# Altium schematic sheet schematic.SchDoc
size A3; SheetNumber: 1; SheetTotal: 1
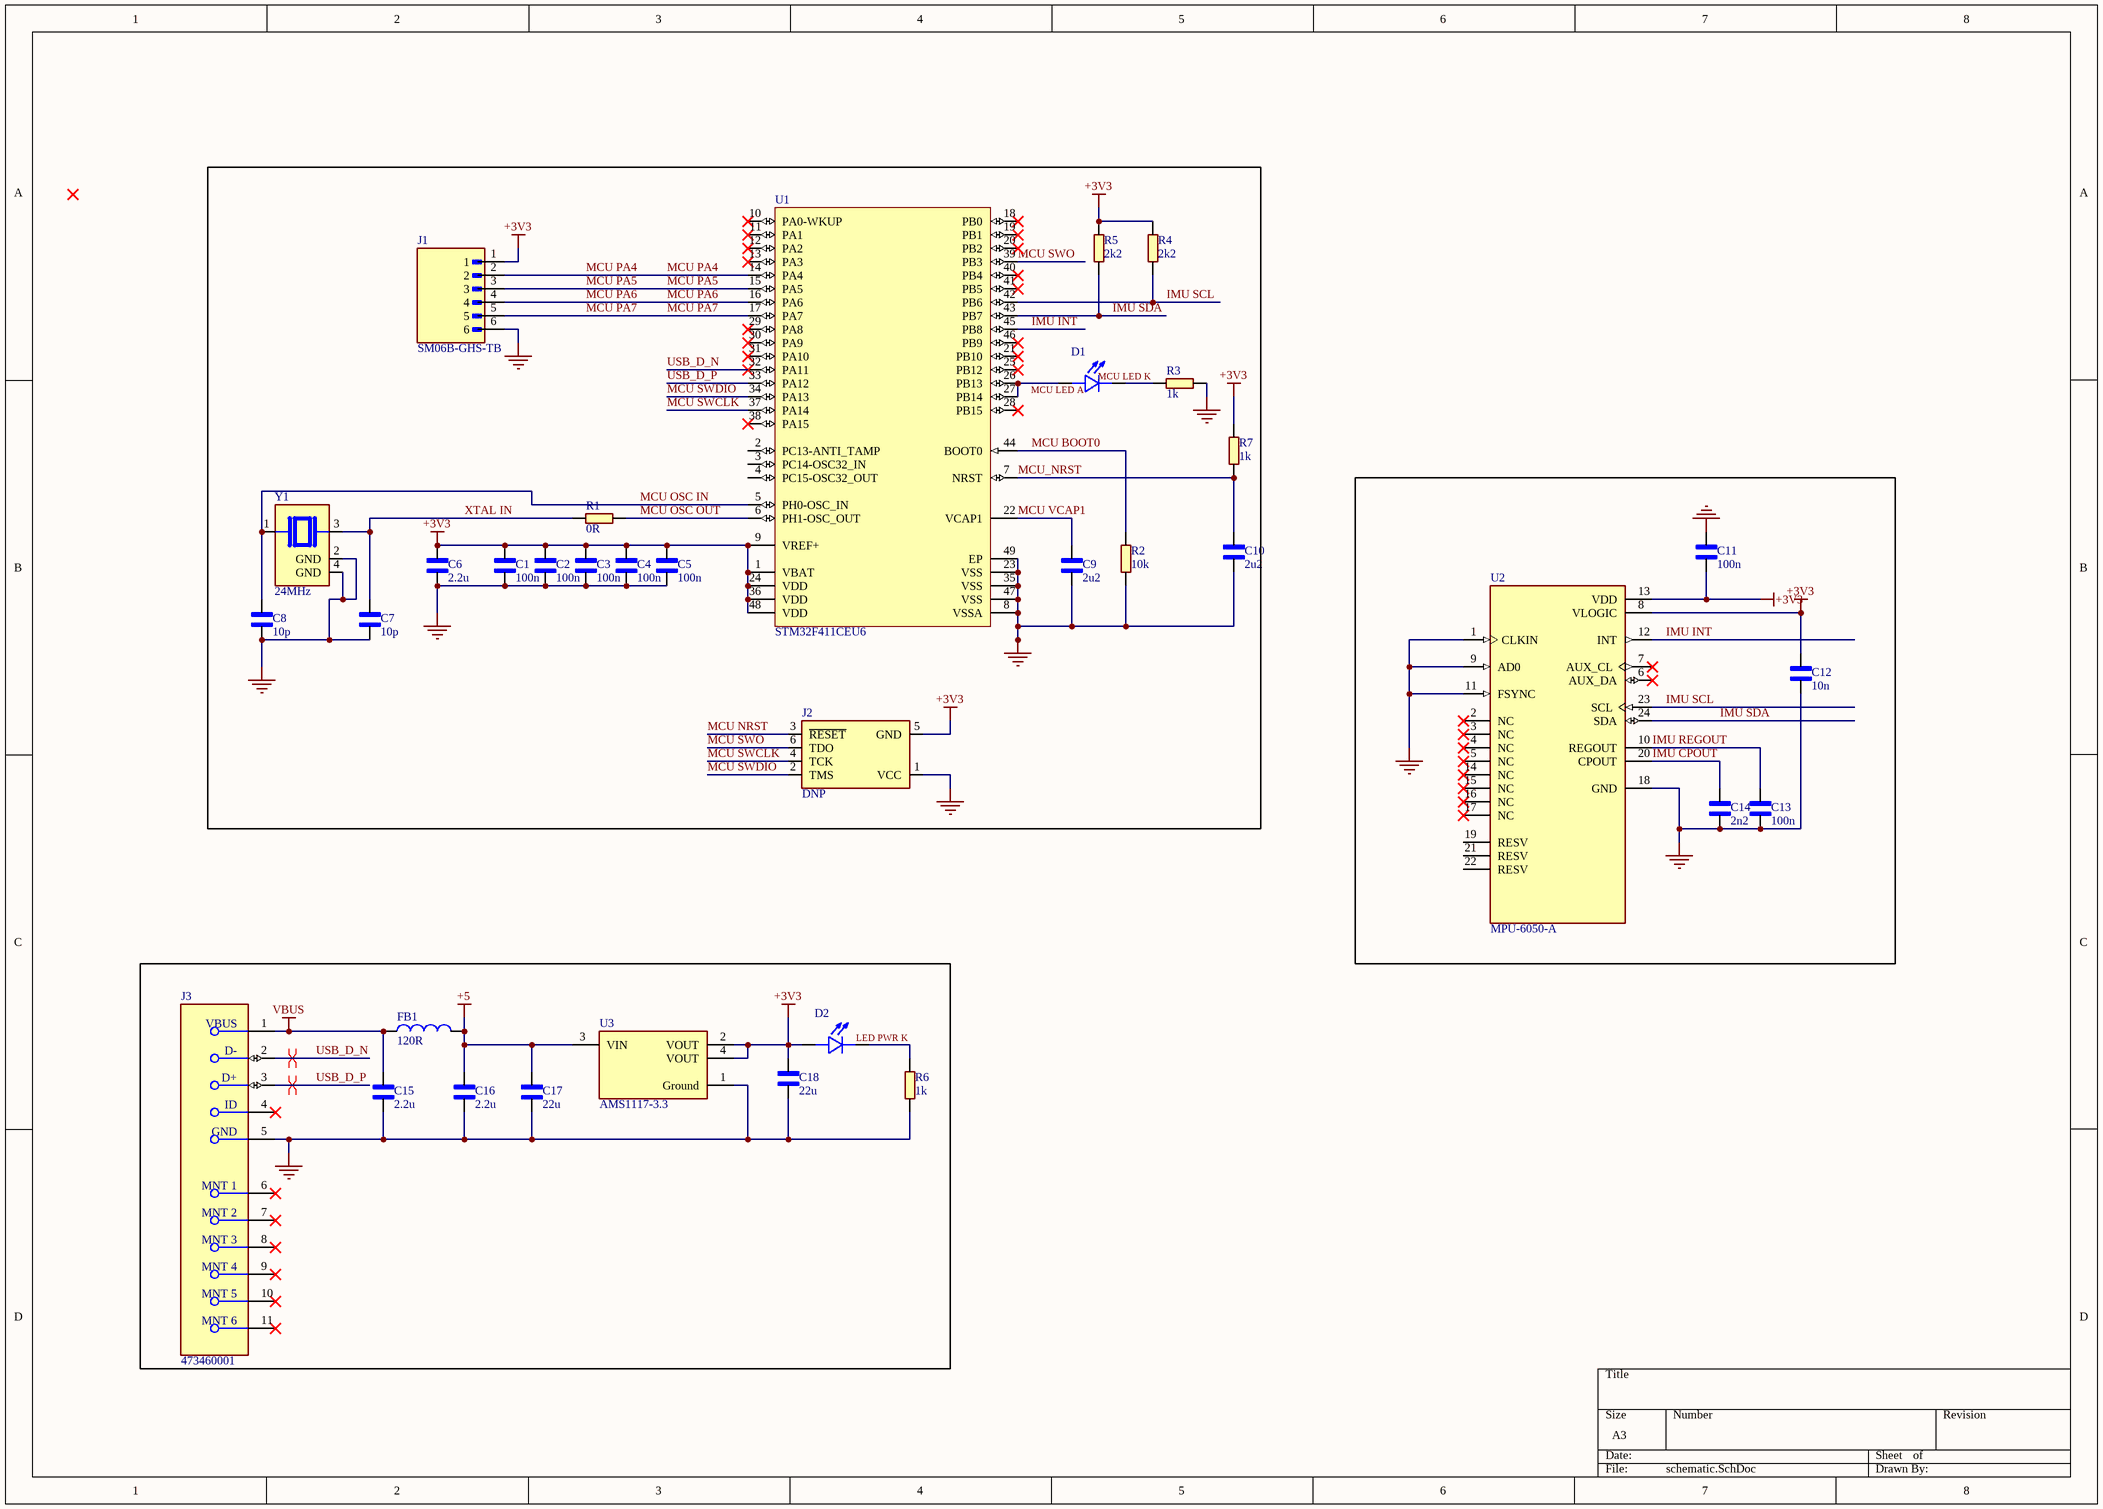
[diagram p0: schematic.SchDoc]

## Parts
C1  100n  [CAPC1005X55N]
C2  100n  [CAPC1005X55N]
C3  100n  [CAPC1005X55N]
C4  100n  [CAPC1005X55N]
C5  100n  [CAPC1005X55N]
C6  2.2u  [CAPC1608X90N]
C7  10p  [CAPC1005X55N]
C8  10p  [CAPC1005X55N]
C9  2u2  [CAPC1608X90N]
C10  2u2  [CAPC1005X55N]
C11  100n  [CAPC1005X55N]
C12  10n  [CAPC1005X55N]
C13  100n  [CAPC1005X55N]
C14  2n2  [CAPC1005X55N]
C15  2.2u  [CAPC1608X90N]
C16  2.2u  [CAPC1608X90N]
C17  22u  [CAPC1608X90N]
C18  22u  [CAPC1608X90N]
D1  APHHS1005LSECK/J3-PF  [LED_APHHS1005LSECK/J3-PF]  (value not drawn)
D2  APHHS1005LCGCK  [LED_APHHS1005LCGCK]  (value not drawn)
FB1  120R  [WE-PF_1280]
J1  SM06B-GHS-TB  [JST_SM06B-GHS-TB]
J2  DNP  [TC2030-IDC-NL]
J3  473460001  [FP-473460001-MFG]
R1  0R  [0402]
R2  10k  [0402]
R3  1k  [0402]
R4  2k2  [0402]
R5  2k2  [0402]
R6  1k  [0402]
R7  1k  [0402]
U1  STM32F411CEU6  [STM-UFQFPN48_L]
U2  MPU-6050-A  [QFN50P400X400X95-24N]
U3  AMS1117-3.3  [FP-AMS1117-IPC_C]
Y1  24MHz  [XTAL_TSX-3225_24.0000MF15V-C0]

## Nets
+3V3: C1.2 C2.2 C3.2 C4.2 C5.2 C6.2 C11.1 C12.2 C18.2 D2.2(A) J1.1 J2.5(GND) R4.2 R5.2 R7.1 U1.1(VBAT) U1.9(VREF+) U1.24(VDD) U1.36(VDD) U1.48(VDD) U2.8(VLOGIC) U2.13(VDD) U3.2(VOUT) U3.4(VOUT)  [also labelled VCC]
+5: C16.2 C17.2 FB1.2 U3.3(VIN)
GND: C1.1 C2.1 C3.1 C4.1 C5.1 C6.1 C7.1 C8.1 C9.1 C10.1 C11.2 C12.1 C13.1 C14.1 C15.1 C16.1 C17.1 C18.1 J1.6 J2.1(VCC) J3.5(GND) R2.1 R3.1 R6.1 U1.8(VSSA) U1.23(VSS) U1.35(VSS) U1.47(VSS) U1.49(EP) U2.1(CLKIN) U2.9(AD0) U2.11(FSYNC) U2.18(GND) U3.1(Ground) Y1.2(GND) Y1.4(GND)
VBUS: C15.2 FB1.1 J3.1(VBUS)
IMU CPOUT: C14.2 U2.20(CPOUT)
IMU INT: U1.45(PB8) U2.12(INT)
IMU REGOUT: C13.2 U2.10(REGOUT)
IMU SCL: R4.1 U1.42(PB6) U2.23(SCL)
IMU SDA: R5.1 U1.43(PB7) U2.24(SDA)
MCU BOOT0: R2.2 U1.44(BOOT0)
MCU LED K: D1.1(C) R3.2
MCU NRST: J2.3(~{RESET})
MCU OSC IN: C8.2 U1.5(PH0-OSC_IN) Y1.1
MCU OSC OUT: R1.2 U1.6(PH1-OSC_OUT)
MCU PA4: J1.2 U1.14(PA4)
MCU PA5: J1.3 U1.15(PA5)
MCU PA6: J1.4 U1.16(PA6)
MCU PA7: J1.5 U1.17(PA7)
MCU SWCLK: J2.4(TCK) U1.37(PA14)
MCU SWDIO: J2.2(TMS) U1.34(PA13)
MCU SWO: J2.6(TDO) U1.39(PB3)
MCU VCAP1: C9.2 U1.22(VCAP1)
MCU_NRST: C10.2 R7.2 U1.7(NRST)
USB_D_N: J3.2(D-) U1.32(PA11)
USB_D_P: J3.3(D+) U1.33(PA12)
XTAL IN: C7.2 R1.1 Y1.3
NetD1_2: D1.2(A) U1.26(PB13) U1.27(PB14)
NetD2_1: D2.1(C) R6.2

Not connected (* = marked no-connect by the designer): J3 4(ID)* 6(MNT_1)* 7(MNT_2)* 8(MNT_3)* 9(MNT_4)* 10(MNT_5)* 11(MNT_6)*; U1 2(PC13-ANTI_TAMP) 3(PC14-OSC32_IN) 4(PC15-OSC32_OUT) 10(PA0-WKUP)* 11(PA1)* 12(PA2)* 13(PA3)* 18(PB0)* 19(PB1)* 20(PB2)* 21(PB10)* 25(PB12)* 28(PB15)* 29(PA8)* 30(PA9)* 31(PA10)* 38(PA15)* 40(PB4)* 41(PB5)* 46(PB9)*; U2 2(NC)* 3(NC)* 4(NC)* 5(NC)* 6(AUX_DA)* 7(AUX_CL)* 14(NC)* 15(NC)* 16(NC)* 17(NC)* 19(RESV) 21(RESV) 22(RESV)

## Layout directives
differential pair: USB_D_N, USB_D_P

## Notes on the sheet
- Labels drawn without touching a wire or pin: LED PWR K, MCU LED A

## Library data of the parts
C1-C5 C7 C8 C10-C14 = C0402C103K4RAC: 10000 pF Â±10% 16V Ceramic Capacitor X7R 0402 (1005 Metric); MF: KEMET; SnapEDA_Link: https://www.snapeda.com/parts/C0402C103K4RAC/KEMET/view-part/?ref=snap; Package: 402-2 KEMET; Value: *; MP: C0402C103K4RAC; Check_prices: https://www.snapeda.com/parts/C0402C103K4RAC/KEMET/view-part/?ref=eda
C6 C9 C15-C18 = C0603C104J4RAC: 0.1 ÂµF Â±5% 16V Ceramic Capacitor X7R 0603 (1608 Metric); MF: KEMET; SnapEDA_Link: https://www.snapeda.com/parts/C0603C104J4RAC/KEMET/view-part/?ref=snap; Package: 603-2 KEMET; Value: *; MP: C0603C104J4RAC; Check_prices: https://www.snapeda.com/parts/C0603C104J4RAC/KEMET/view-part/?ref=eda
D1 = APHHS1005LSECK/J3-PF: Red 625nm LED Indication - Discrete 1.8V 0402 (1005 Metric); MF: Kingbright; SnapEDA_Link: https://www.snapeda.com/parts/APHHS1005LSECK/J3-PF/Kingbright/view-part/?ref=snap; Package: 0402 Kingbright Corporation; Value: *; MP: APHHS1005LSECK/J3-PF; Check_prices: https://www.snapeda.com/parts/APHHS1005LSECK/J3-PF/Kingbright/view-part/?ref=eda
D2 = APHHS1005LCGCK: Green 570nm LED Indication - Discrete 1.9V 0402 (1005 Metric); MF: Kingbright; SnapEDA_Link: https://www.snapeda.com/parts/APHHS1005LCGCK/Kingbright/view-part/?ref=snap; Package: 0402 Kingbright Corporation; Value: *; MP: APHHS1005LCGCK; Check_prices: https://www.snapeda.com/parts/APHHS1005LCGCK/Kingbright/view-part/?ref=eda
FB1 = WE-PF_1280: FERRITE BEAD 185 OHM 2SMD 1LN; MF: WÃ¼rth Elektronik; MP: 7427929115; SnapEDA_Link: https://www.snapeda.com/parts/7427929115/W%25C3%25BCrth+Elektronik+Midcom/view-part/?ref=snap; Package: SMD-2 WÃ¼rth Elektronik; Value: *; Check_prices: https://www.snapeda.com/parts/7427929115/W%25C3%25BCrth+Elektronik+Midcom/view-part/?ref=eda
J1 = SM06B-GHS-TB: Connector Header Surface Mount, Right Angle 6 position 0.049 (1.25mm); MF: JST Sales; SnapEDA_Link: https://www.snapeda.com/parts/SM06B-GHS-TB/JST/view-part/?ref=snap; Package: None; Value: *; MP: SM06B-GHS-TB; Check_prices: https://www.snapeda.com/parts/SM06B-GHS-TB/JST/view-part/?ref=eda
J2 = TC2030-CTX: CortexÂ® Plug-Of-Nailsâ„¢ Adapter Cable; MF: Tag-Connect LLC; Availability: Unavailable; Package: None; MP: TC2030-CTX; SnapEDA_Link: https://www.snapeda.com/parts/TC2030-CTX/Tag-Connect%20LLC/view-part/225831/?ref=snap; Value: *; Price: None
J3 = CMP-2000-05246-2: CONN RCPT USB2.0 MICRO B SMD R/A; Manufacturer: Molex; Conn Orientation: Right Angle; Is Female: yes; Shielding: true; Pitch: 0.65mm; Number Of Contacts: 5; Voltage Rating: 30V; Current Rating: 1.8A; Device Class L2: USB Connectors; Digikey Description: CONN RCPT USB2.0 MICRO B SMD R/A; Height: 2.945mm; RoHS: TRUE; ComponentLink2Description: Datasheet; Octopart: https://octopart.com/47346-0001-molex-7164928; Automotive: No; Package: 0; Category: Conn; Device Class L1: Connectors; Usb Standard: USB 2.0; Temperature: -30°C to +85°C; Temperature Range Low: -30°C; Footprint Url: https://www.molex.com/pdm_docs/sd/473460001_sd.pdf; ComponentLink2URL: https://www.molex.com/webdocs/datasheets/pdf/en-us/0473460001_IO_CONNECTORS.pdf; Lead Free: Yes; Manufacturer Part Number: 473460001; Contact Material: Gold,Nickel; Temperature Range High: +85°C; Device Class L3: unset
R1-R7 = R0402: Reducer,NEMA 1,4 X 2 1/2 | Wiegmann R0402; SnapEDA_Link: https://www.snapeda.com/parts/R0402/Wiegmann/view-part/?ref=snap; Package: None; Value: *; MF: Wiegmann; MP: R0402; Check_prices: https://www.snapeda.com/parts/R0402/Wiegmann/view-part/?ref=eda
U1 = CMP-0243-00165-1: ARM Cortex-M4 32-bit MCU+FPU, 512 KB Flash, 128 KB RAM, 36 I/Os, 48-Pin UFQFPN, -40 to 85 degC, Tray; Operating Frequency(F) (Processor speed) (MHz): 100; FLASH Size (Prog) (kB): 512; Internal RAM Size (kB): 128; I/Os (High Current): 36; Supply Voltage(Vcc) min (V): 1.7; Package Reference: 48-Pin Ultra Thin Fine Pitch Quad Flat No-Lead, 7 x 7 x 0.6 mm Body, 0.5 mm Pitch, Exposed Pad; ComponentLink1Description: Manufacturer URL; ComponentLink1URL: http://www.st.com/; Packing: Tray; Package Description: UFQFPN48; Core: ARM Cortex-M4; ComponentLink2Description: Datasheet; ComponentLink2URL: http://www.st.com/st-web-ui/static/active/en/resource/technical/document/datasheet/DM00115249.pdf; DatasheetVersion: Rev. 6; Mounting Technology: Surface Mount
U2 = MPU-6050-A: MF: TDK InvenSense; SnapEDA_Link: https://www.snapeda.com/parts/MPU-6050-A/InvenSense/view-part/?ref=snap; Package: None; Value: *; MP: MPU-6050-A; Check_prices: https://www.snapeda.com/parts/MPU-6050-A/InvenSense/view-part/?ref=eda
U3 = CMP-209535-000001-1: LDO Voltage Regulators 1A, 3.3V; Manufacturer: Advanced Monolithic Systems; Dropout Voltage: 1.1V; Output Type: Fixed; Nominal Supply Current: 5mA; Max Power Dissipation: 1.2W; Max Supply Voltage: 15V; Number Of Outputs: 1; Standoff Height: 0.64mm; Max Junction Temp: +125°C; Height: 1.8mm; Package: AMS1117; Device Class L2: Power Management ICs; ComponentLink2Description: Datasheet; ComponentLink2URL: http://www.advanced-monolithic.com/pdf/ds1117.pdf; Category: IC; RoHS: TRUE; Automotive: No; Device Class L1: Integrated Circuits (ICs); Output Current: 1A; Device Class L3: Voltage Regulators - Linear; Temperature: -40°C to +125°C; Output Voltage: 3.3V; Manufacturer Part Number: AMS1117-3.3; Temperature Range Low: -40°C; Octopart: https://octopart.com/ams1117-3.3-advanced+monolithic+systems-25899300; Lead Free: Yes; Ipc Land Pattern Name: SOT229P700X180-4; Temperature Range High: +125°C
Y1 = TSX-3225_24.0000MF15V-C0: 24 MHz Â±10ppm Crystal 18pF 40 Ohms 4-SMD, No Lead; MF: EPSON; MP: TSX-3225 24.0000MF15V-C0; Check_prices: https://www.snapeda.com/parts/TSX-3225%2024.0000MF15V-C0/EPSON/view-part/?ref=eda; SnapEDA_Link: https://www.snapeda.com/parts/TSX-3225%2024.0000MF15V-C0/EPSON/view-part/?ref=snap; Digi-Key_Part_Number: SER4209TR-ND; Value: *; Purchase-URL: https://pricing.snapeda.com/search/part/TSX-3225 24.0000MF15V-C0/?ref=eda; Package: NON STANDARD-4 EPSON